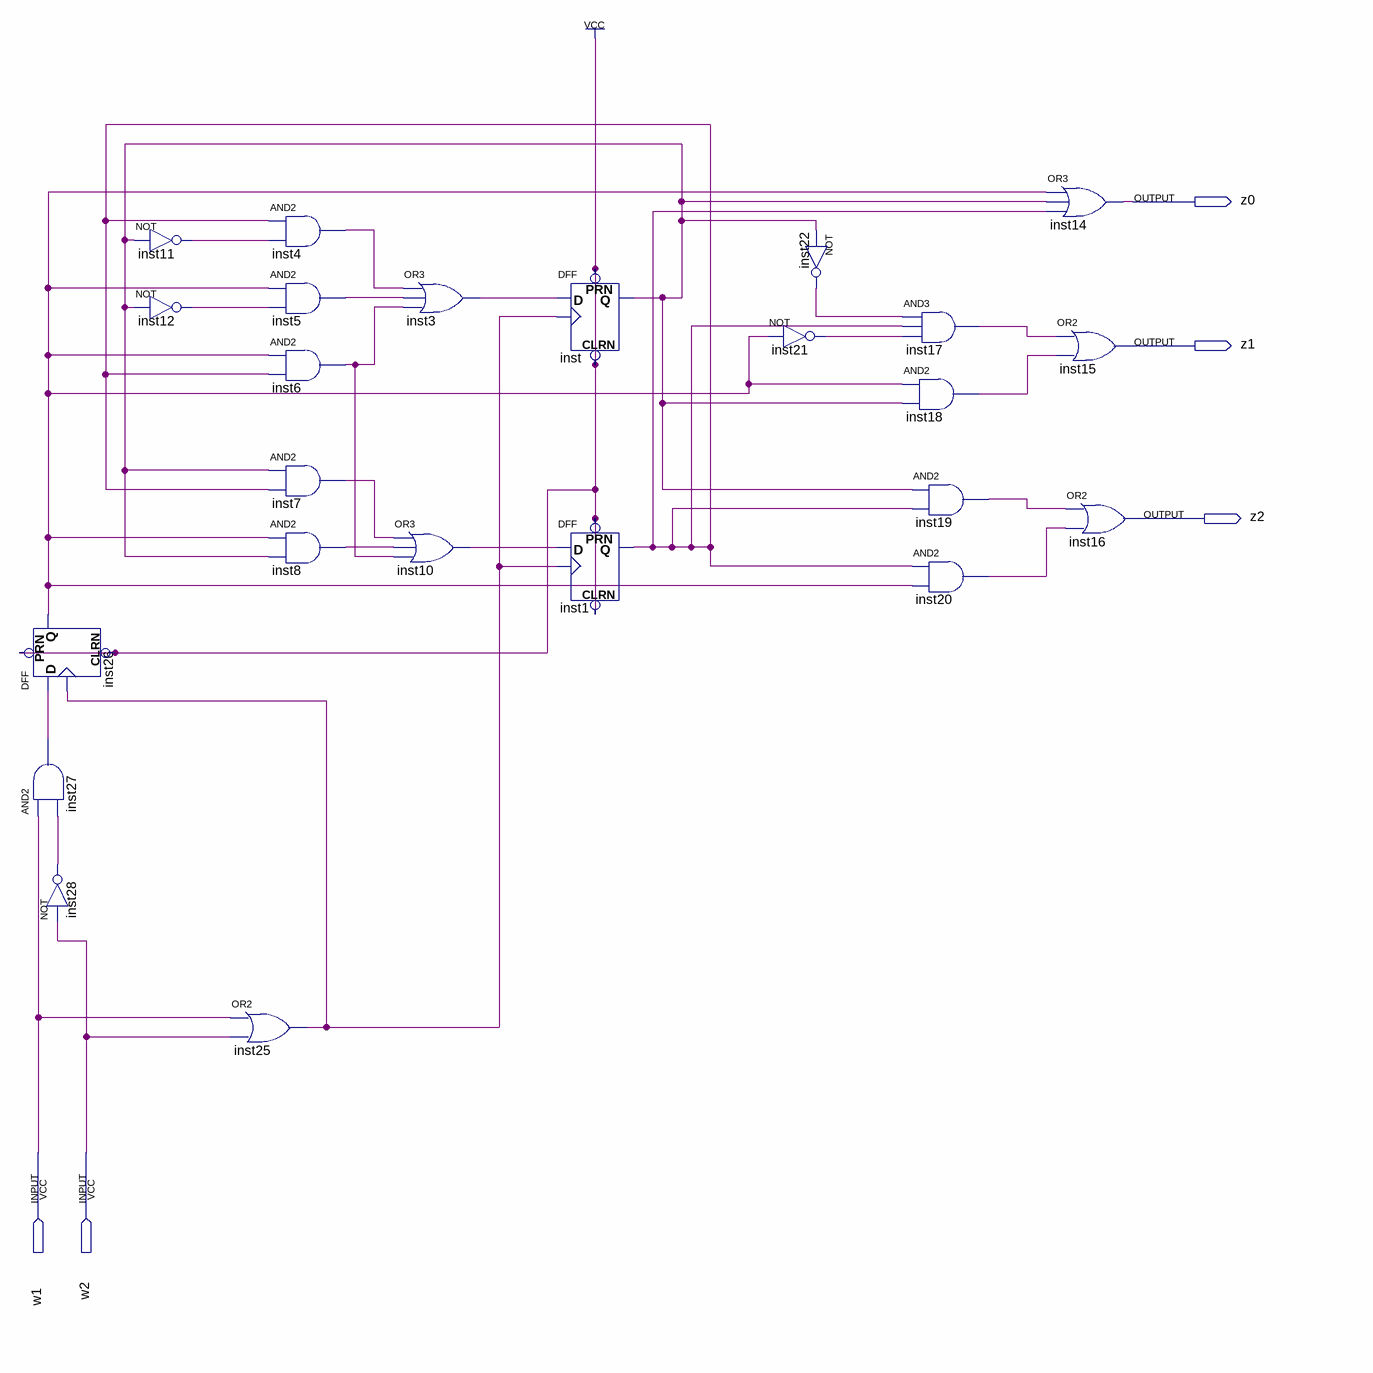
[diagram p0: schematic sheet]
// Quartus schematic State_Machine.bdf as structural Verilog: 24 symbols, 5 pins
module State_Machine (
  input  w1,
  input  w2,
  output z0,
  output z1,
  output z2
);

  wire inst1_q, inst3_out, inst4_out, inst5_out, inst6_out, inst7_out, inst8_out, inst10_out, inst11_out,
       inst12_out, inst17_out, inst18_out, inst19_out, inst20_out, inst21_out, inst22_out, inst25_out,
       inst26_q, inst27_out, inst28_out, inst_q;

  DFF inst26 (.CLRN(1'b1), .CLK(inst25_out), .D(inst27_out), .PRN(1'b1), .Q(inst26_q));
  and inst27 (inst27_out, w1, inst28_out);
  not inst28 (inst28_out, w2);
  not inst11 (inst11_out, inst_q);
  not inst12 (inst12_out, inst_q);
  or inst25 (inst25_out, w1, w2);
  and inst4 (inst4_out, inst1_q, inst11_out);
  and inst5 (inst5_out, inst26_q, inst12_out);
  and inst6 (inst6_out, inst26_q, inst1_q);
  and inst7 (inst7_out, inst_q, inst1_q);
  and inst8 (inst8_out, inst26_q, inst_q);
  or inst3 (inst3_out, inst4_out, inst5_out, inst6_out);
  or inst10 (inst10_out, inst7_out, inst8_out, inst6_out);
  DFF inst (.CLRN(1'b1), .CLK(inst25_out), .D(inst3_out), .PRN(1'b1), .Q(inst_q));
  DFF inst1 (.CLRN(1'b1), .CLK(inst25_out), .D(inst10_out), .PRN(1'b1), .Q(inst1_q));
  not inst22 (inst22_out, inst_q);
  not inst21 (inst21_out, inst26_q);
  and inst17 (inst17_out, inst22_out, inst1_q, inst21_out);
  and inst18 (inst18_out, inst26_q, inst_q);
  and inst19 (inst19_out, inst_q, inst1_q);
  and inst20 (inst20_out, inst1_q, inst26_q);
  or inst14 (z0, inst26_q, inst_q, inst1_q);
  or inst15 (z1, inst17_out, inst18_out);
  or inst16 (z2, inst19_out, inst20_out);
endmodule
